# Altium project Tiny817_Xplained_Pro.PrjPCB (part 2 of 2)

## Sheet Tiny817_Xplained_Pro_current_measurement_control.SchDoc: Current measurement control
size A3; Organization: ATMEL Norway; Address1: Vestre Rosten 79; Address2: N-7075 TILLER; Address3: NORWAY; DocumentNumber: A09-2654; Revision: 8; SheetNumber: 6; SheetTotal: 9; PageSetup: Record=PageOptions|CenterHorizontal=True|CenterVertical=True|PrintScale=1.01|XCorrection=1.00|YCorrection=1.00|PrintKind=1|BorderSize=5000000|LeftOffset=0|BottomOffset=0|Orientation=2|PaperLength=1000|PaperWidth=1000|Scale=100|PaperSource=7|PrintQuality=-4|MediaType=1|DitherType=10|PaperKind=A3 (297 x 420 mm)|PrintScaleMode=1; ProjectTitle: Tiny817 Xplained Pro; PCBNumber: A08-2506; PCBRevision: 4
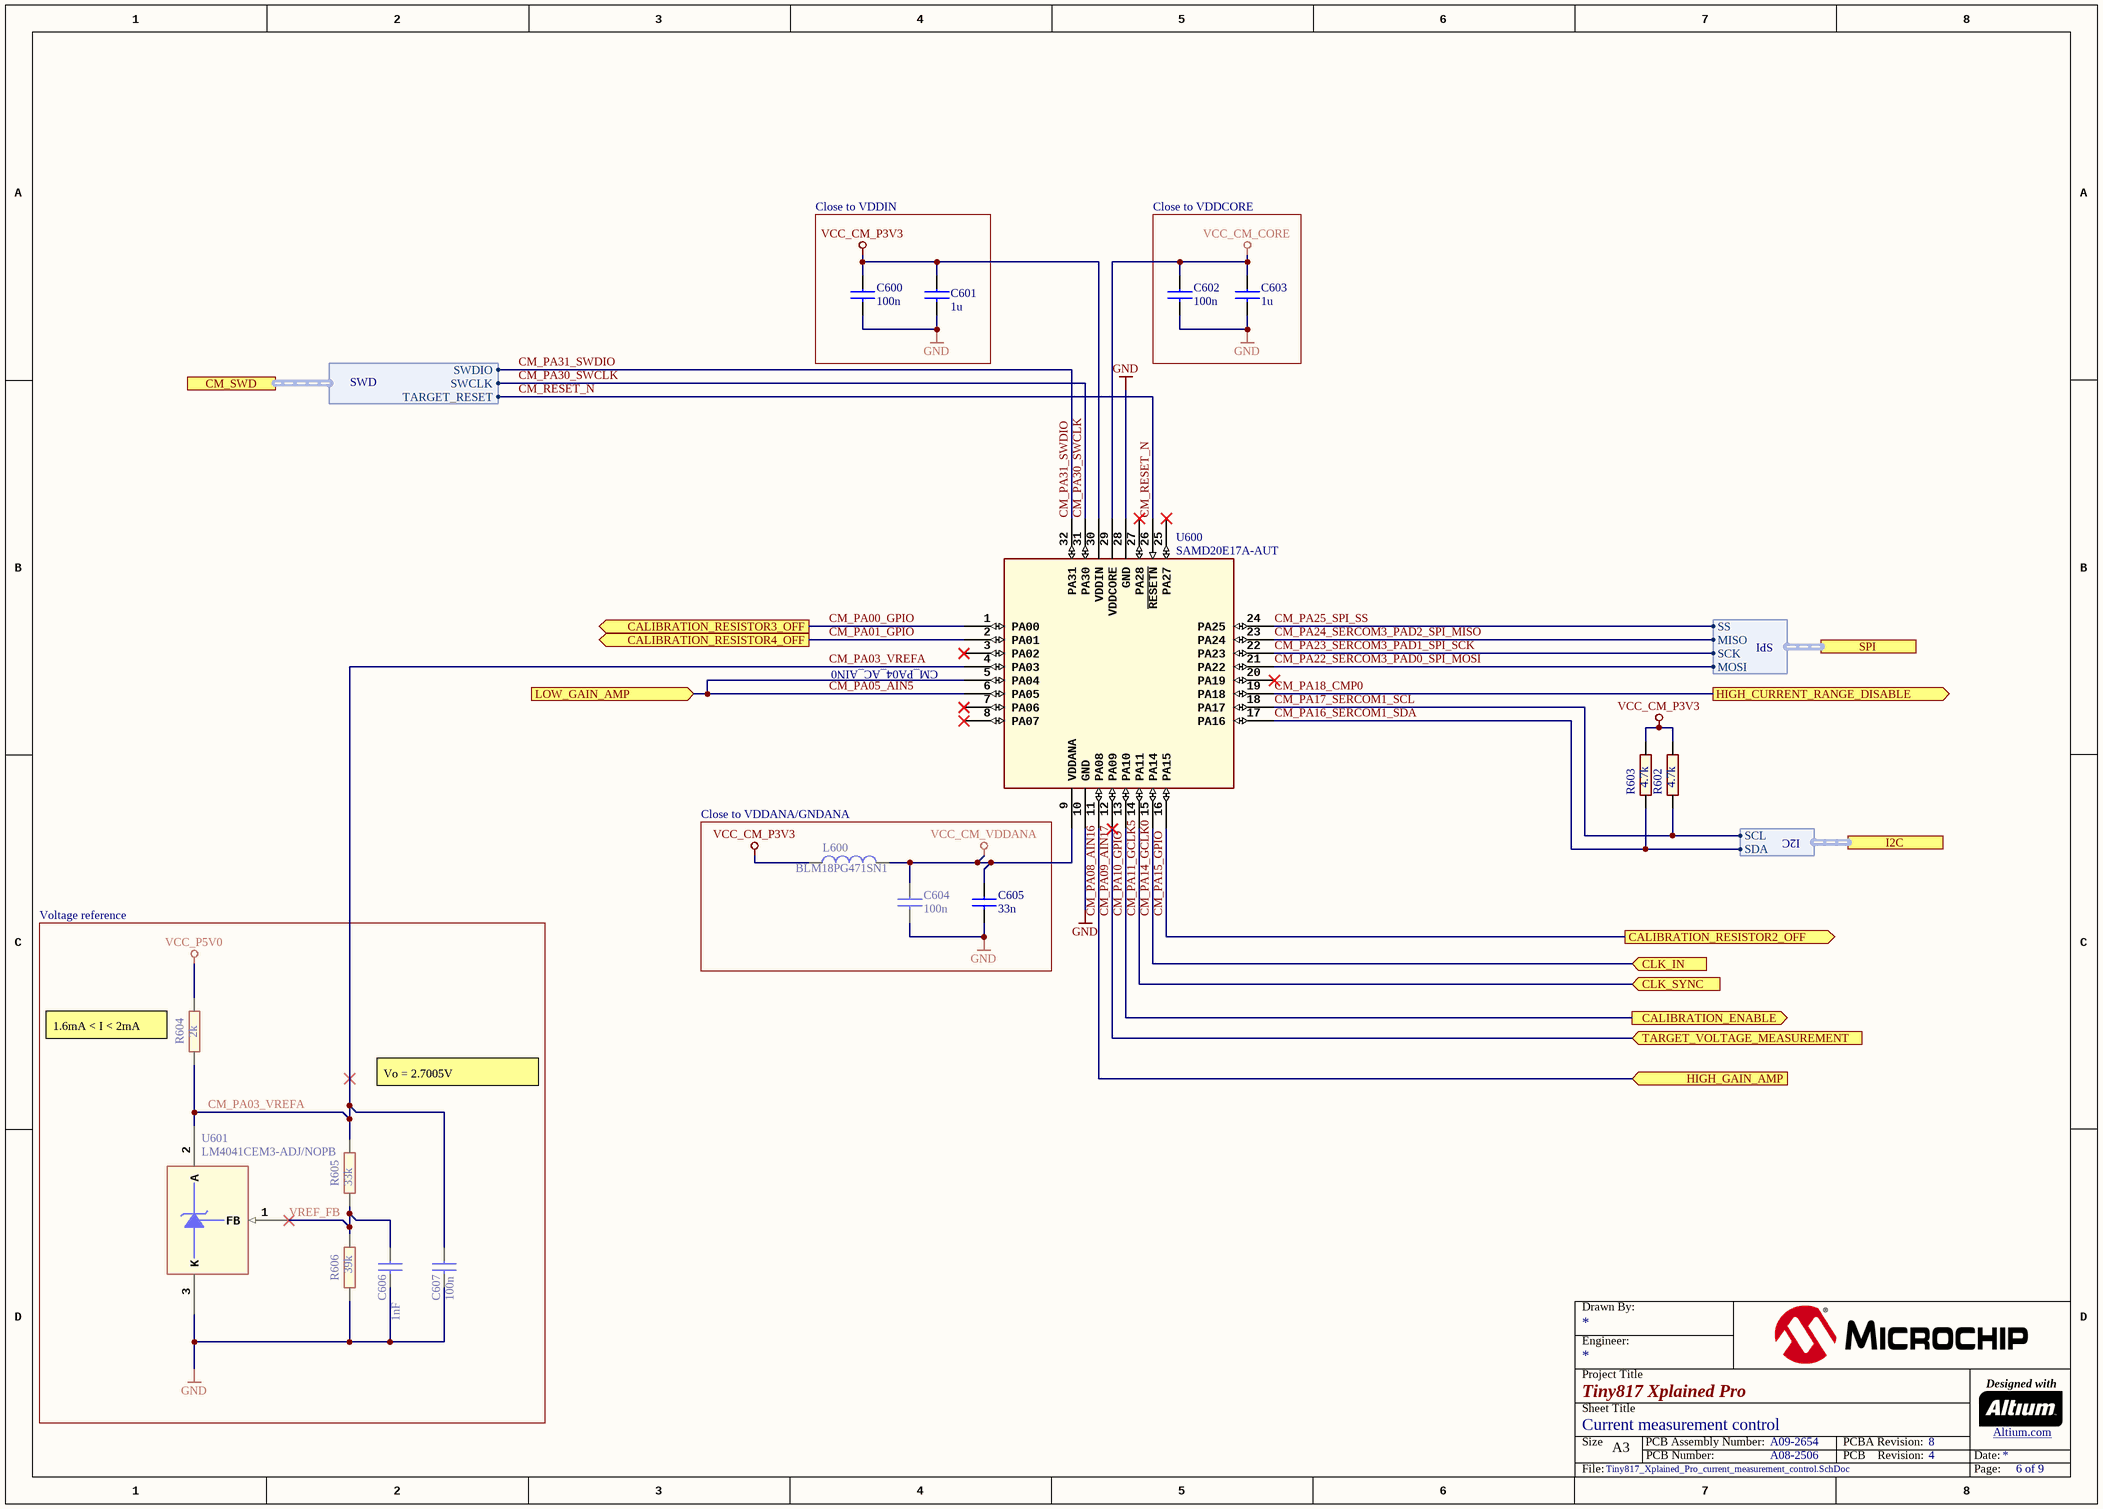
[diagram p7: Tiny817_Xplained_Pro_current_measurement_control.SchDoc]

### Parts
C600  value 100n  [AP1-00053]
C601  value 1u  [AP1-00001]
C602  value 100n  [AP1-00053]
C603  value 1u  [AP1-00001]
C604  value 100n  [AP1-00053]
C605  value 33n  [AP1-00053]
C606  value 1nF  [AP1-00053]
C607  value 100n  [AP1-00053]
L600  value BLM18PG471SN1  [AP3-00005]
R602  value 4.7k  [AP2-00011]
R603  value 4.7k  [AP2-00011]
R604  value 2k  [AP2-00011]
R605  value 33k  [AP2-00011]
R606  value 39k  [AP2-00011]
U600  value SAMD20E17A-AUT  [AP6-00061]
U601  value LM4041CEM3-ADJ/NOPB  [AP5-00002]

### Blocks framed on the sheet
Close to VDDIN: C600 C601
Close to VDDCORE: C602 C603
Close to VDDANA/GNDANA: C604 C605 L600
Voltage reference: C606 C607 R604-R606 U601

### Ports
CALIBRATION_ENABLE (out), CALIBRATION_RESISTOR2_OFF (out), CALIBRATION_RESISTOR3_OFF (out), CALIBRATION_RESISTOR4_OFF (out), CLK_IN (in), CLK_SYNC (in), CM_SWD (harness SWD), HIGH_CURRENT_RANGE_DISABLE (out), HIGH_GAIN_AMP (in), I2C (harness I2C), LOW_GAIN_AMP (in), SPI (harness SPI), TARGET_VOLTAGE_MEASUREMENT (in)

### Harnesses
SPI: MISO, MOSI, SCK, SS
I2C: SCL, SDA
SWD: SWCLK, SWDIO, TARGET_RESET

### Nets
GND: C600.2 C601.2 C602.2 C603.2 C604.2 C605.2 C606.2 C607.2 R606.1 U600.10(GND) U600.28(GND) U601.3(K)
VCC_CM_CORE: C602.1 C603.1 U600.29(VDDCORE)
VCC_CM_P3V3: C600.1 C601.1 L600.1 R602.2 R603.2 U600.30(VDDIN)
VCC_CM_VDDANA: C604.1 C605.1 L600.2 U600.9(VDDANA)
VCC_P5V0: R604.2
CM_PA00_GPIO: U600.1(PA00) ; port CALIBRATION_RESISTOR3_OFF
CM_PA01_GPIO: U600.2(PA01) ; port CALIBRATION_RESISTOR4_OFF
CM_PA03_VREFA: C607.1 R604.1 R605.2 U600.4(PA03) U601.2(A)
CM_PA05_AIN5: U600.5(PA04) U600.6(PA05) ; port LOW_GAIN_AMP
CM_PA08_AIN16: U600.11(PA08) ; port HIGH_GAIN_AMP
CM_PA09_AIN17: U600.12(PA09) ; port TARGET_VOLTAGE_MEASUREMENT
CM_PA10_GPIO: U600.13(PA10) ; port CALIBRATION_ENABLE
CM_PA11_GCLK5: U600.14(PA11) ; port CLK_SYNC
CM_PA14_GCLK0: U600.15(PA14) ; port CLK_IN
CM_PA15_GPIO: U600.16(PA15) ; port CALIBRATION_RESISTOR2_OFF
CM_PA16_SERCOM1_SDA: R603.1 U600.17(PA16) ; port I2C.SDA
CM_PA17_SERCOM1_SCL: R602.1 U600.18(PA17) ; port I2C.SCL
CM_PA18_CMP0: U600.19(PA18) ; port HIGH_CURRENT_RANGE_DISABLE
CM_PA22_SERCOM3_PAD0_SPI_MOSI: U600.21(PA22) ; port SPI.MOSI
CM_PA23_SERCOM3_PAD1_SPI_SCK: U600.22(PA23) ; port SPI.SCK
CM_PA24_SERCOM3_PAD2_SPI_MISO: U600.23(PA24) ; port SPI.MISO
CM_PA25_SPI_SS: U600.24(PA25) ; port SPI.SS
CM_PA30_SWCLK: U600.31(PA30) ; port CM_SWD.SWCLK
CM_PA31_SWDIO: U600.32(PA31) ; port CM_SWD.SWDIO
CM_RESET_N: U600.26(~{RESETN}) ; port CM_SWD.TARGET_RESET
VREF_FB: C606.1 R605.1 R606.2 U601.1(FB)

Not connected (* = marked no-connect by the designer): U600 3(PA02)* 7(PA06)* 8(PA07)* 20(PA19)* 25(PA27)* 27(PA28)*

### Notes on the sheet
- CM_PA04_AC_AIN0
- (near R604) 1.6mA < I < 2mA
- Vo = 2.7005V
- Drawn By:
- Project Title
- Engineer:
- Designed with
- Sheet Title
- Size
- A3
- PCB Number:
- PCB Assembly Number:
- PCBA Revision:
- PCB    Revision:
- Date:
- Altium.com <http://go.altium.com/MicrochipLandingPage_Evaluation.html>
- File:
- Page:

### Library data of the parts
C600 C602 C604 C607 = A01-0246: as C304 on sheet Tiny817_Xplained_Pro_Target_MCU; AN: A01-0246; Tolerance: 16V, +/-10%; Height: 0.5
C601 C603 = A01-0286: Ceramic capacitor, SMD 0402, X5R, 6.3V, +/-10% (de26942); PartGroup: Capacitors,Ceramic,SMD 0402; Manufacturer: Kemet; MPN: C0402C105K9PAC; TemperatureRange: -55 to 85 deg C; AN: A01-0286; Tolerance: +/-10%; Height: 0.5
C605 = A01-0397: Ceramic capacitor, SMD 0402, X7R, 25V, ±10%; PartGroup: Capacitors,Ceramic,SMD 0402; Manufacturer: Murata; MPN: GRM155R71E333KA88D; Tolerance: ±10%(K); TemperatureRange: -55 to 125°C; AN: A01-0397; Height: 0.5
C606 = A01-0321: Ceramic capacitor, SMD 0402, C0G, 50V, +/-5%; PartGroup: Capacitors,Ceramic,SMD 0402; Manufacturer: Murata; MPN: GRM1555C1H102JA01D; Tolerance: 5%; AN: A01-0321; Height: 0.550000011920929
L600 = A03-0035: SMD RF inductor 0603. Z=470Ohm (@100MHz), Max R(dc)=0.20Ohm, Max current=1A; PartGroup: Inductors,EMI; Manufacturer: Murata; TemperatureRange: -55; AN: A03-0035; Height: 0.800000011920929; MPN: BLM18PG471SN1
R602 R603 = A02-0228: Thick film resistor, SMD 0402, 1/16W, 1%; PartGroup: Resistors,SMD,0402 1%; Manufacturer: Panasonic; MPN: ERJ2RKF4701X; TemperatureRange: -55C to +125C; AN: A02-0228; Tolerance: 1 %; Height: 0.349999994039536
R604 = A02-0219: Thick film resistor, SMD 0402, 1/16W, 1%; PartGroup: Resistors,SMD,0402 1%; TemperatureRange: -55 - +125 deg C; AN: A02-0219; Tolerance: 1 %; Height: 0.349999994039536
R605 = A02-0248: Thick film resistor, SMD 0402, 1/16W, 1%; PartGroup: Resistors,SMD,0402 1%; Manufacturer: ASJ Holdings; MPN: CR10-3302-FK; TemperatureRange: -55 - +125 deg C; AN: A02-0248; Tolerance: 1 %; Height: 0.349999994039536
R606 = A02-0250: Thick film resistor, SMD 0402, 1/16W, 1%; PartGroup: Resistors,SMD,0402 1%; Manufacturer: ASJ Holdings; MPN: CR10-3902-FK; TemperatureRange: -55 - +125 deg C; AN: A02-0250; Tolerance: 1 %; Height: 0.349999994039536
U600 = A06-1023: Atmel 32bit RISC MCU 32 pin; PartGroup: Integrated Circuits,MCU, MPU, DSP,ARM MCU; Manufacturer: Microchip; MPN: ATSAMD20E17A-AUT; AN: A06-1023; Height: 1.20000004768372
U601 = A06-0123: Adjustable shunt voltage regulator, 1.24 to 10V out; PartGroup: Integrated Circuits,Regulators,Voltage reference; Manufacturer: Texas Instruments; TemperatureRange: -40 to +85 deg. C; AN: A06-0123; Height: 1; MPN: LM4041CEM3-ADJ/NOPB

## Sheet Tiny817_Xplained_Pro_current_measurement_frontend.SchDoc: Current measurement frontend
size A3; Organization: ATMEL Norway; Address1: Vestre Rosten 79; Address2: N-7075 TILLER; Address3: NORWAY; DocumentNumber: A09-2654; Revision: 8; SheetNumber: 7; SheetTotal: 9; PageSetup: Record=PageOptions|CenterHorizontal=True|CenterVertical=True|PrintScale=1.01|XCorrection=1.00|YCorrection=1.00|PrintKind=1|BorderSize=5000000|LeftOffset=0|BottomOffset=0|Orientation=2|PaperLength=1000|PaperWidth=1000|Scale=100|PaperSource=7|PrintQuality=-4|MediaType=1|DitherType=10|PaperKind=A3 (297 x 420 mm)|PrintScaleMode=1; ProjectTitle: Tiny817 Xplained Pro; PCBNumber: A08-2506; PCBRevision: 4
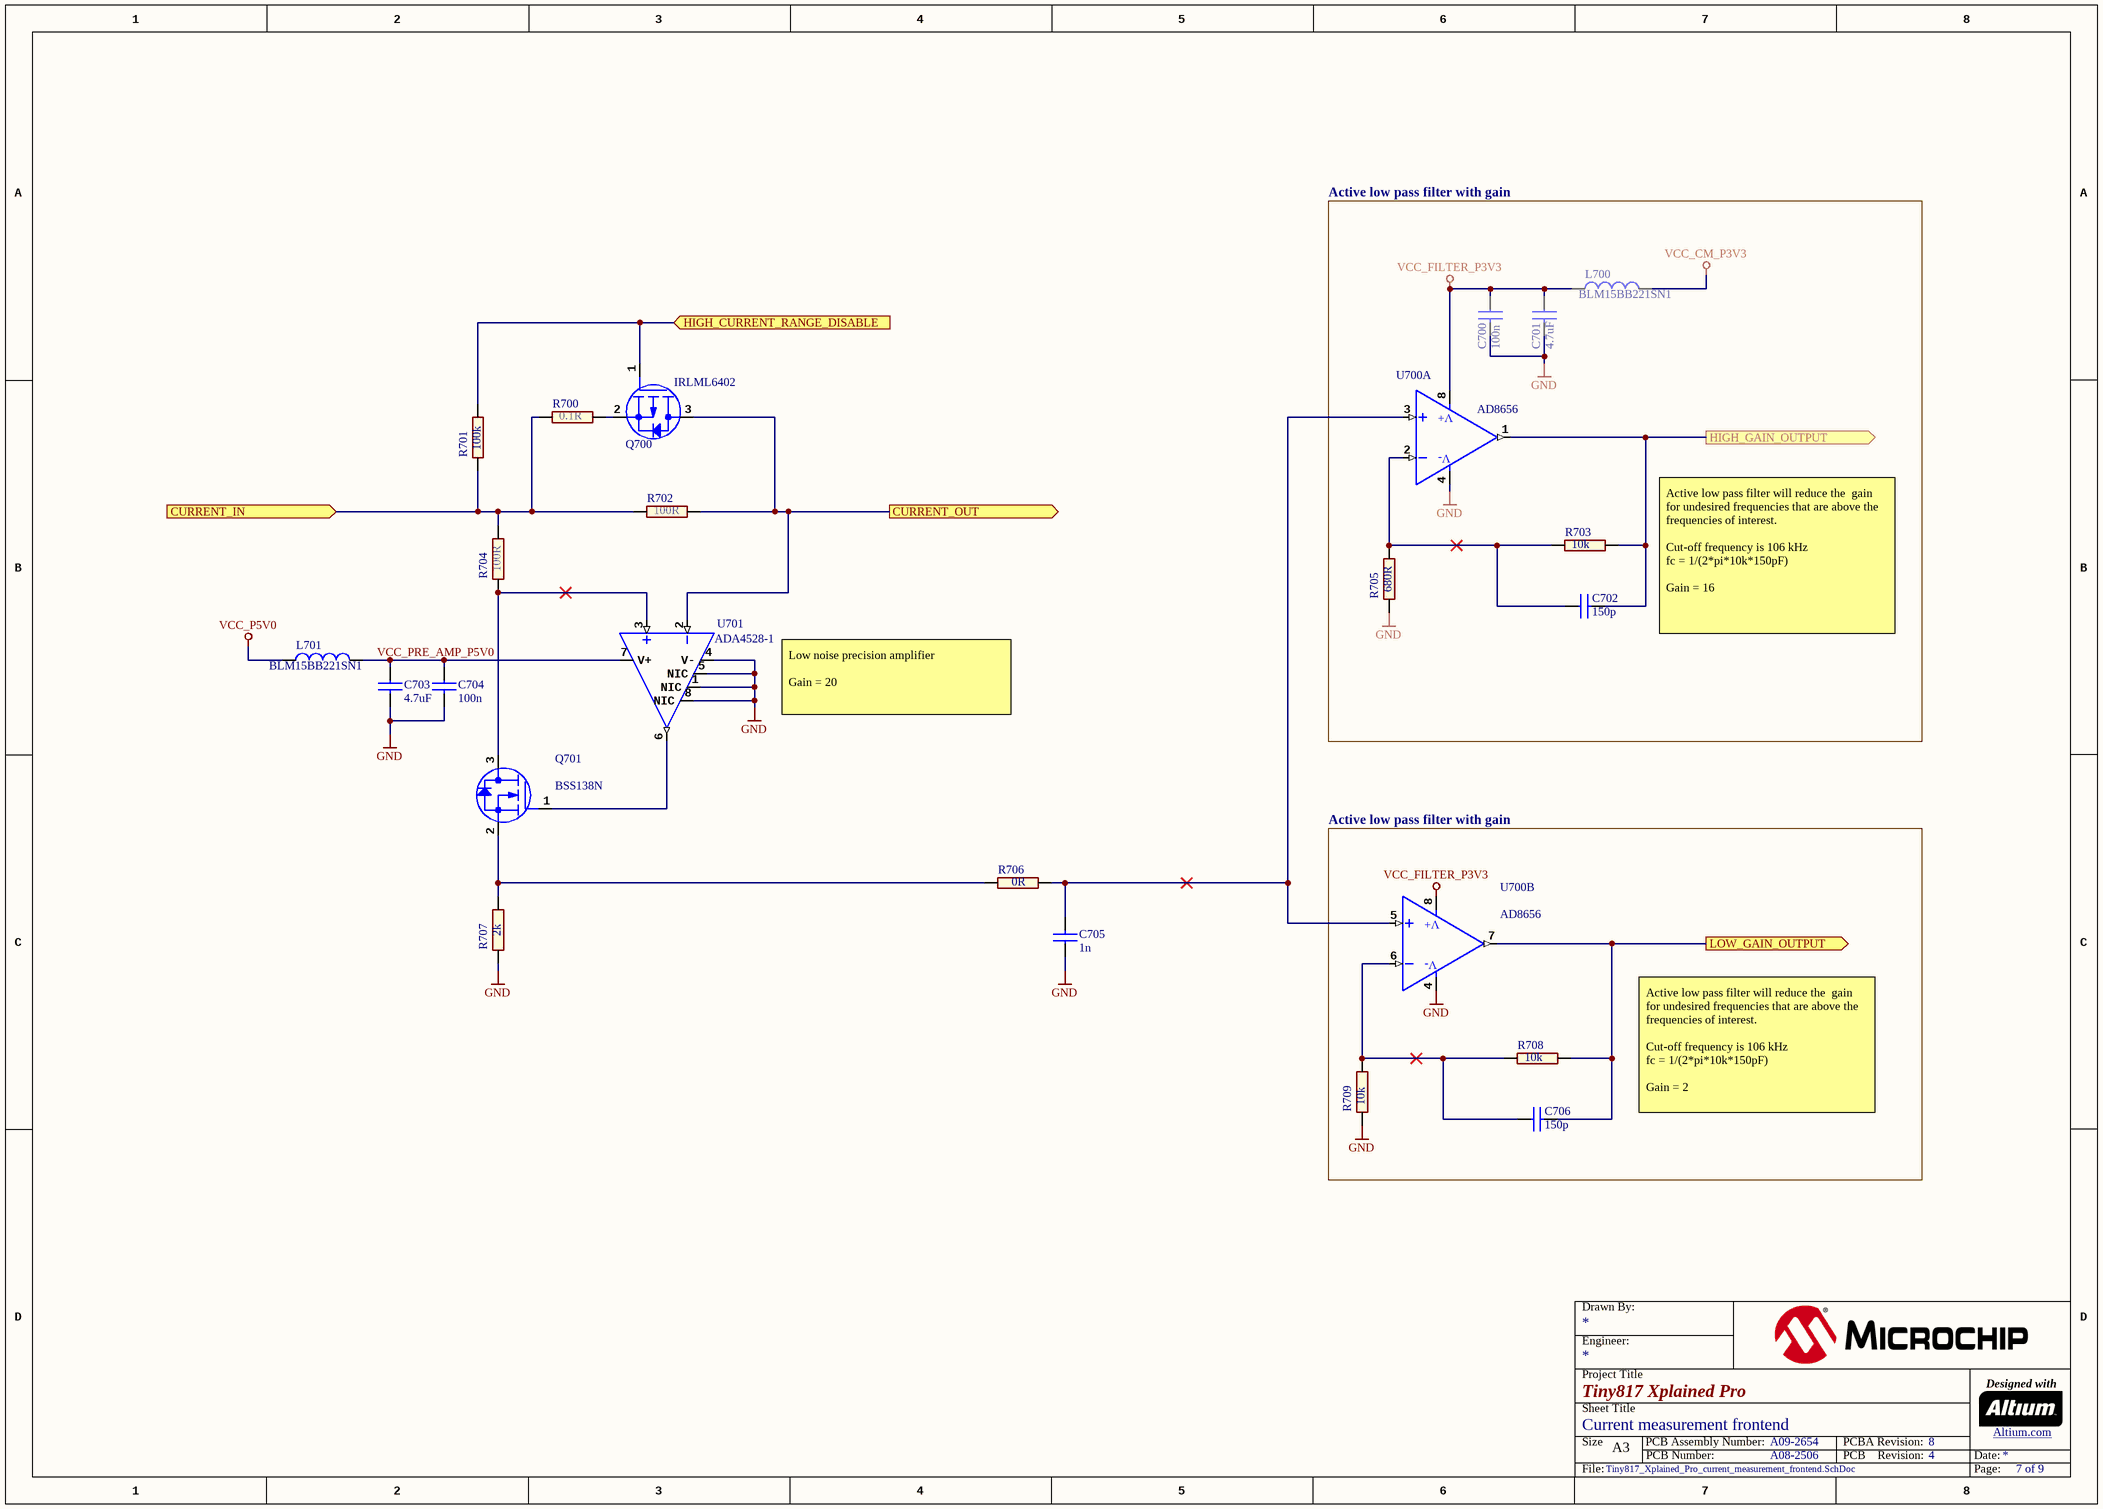
[diagram p8: Tiny817_Xplained_Pro_current_measurement_frontend.SchDoc]

### Parts
C700  value 100n  [AP1-00053]
C701  value 4.7uF  [AP1-00117]
C702  value 150p  [AP1-00053]
C703  value 4.7uF  [AP1-00117]
C704  value 100n  [AP1-00053]
C705  value 1n  [AP1-00053]
C706  value 150p  [AP1-00053]
L700  value BLM15BB221SN1  [AP3-00028]
L701  value BLM15BB221SN1  [AP3-00028]
Q700  value IRLML6402  [AP5-00002]
Q701  value BSS138N  [AP5-00002]
R700  value 0.1R  [AP2-00076]
R701  value 100k  [AP2-00011]
R702  value 100R  [AP2-00076]
R703  value 10k  [AP2-00011]
R704  value 100R  [AP2-00076]
R705  value 680R  [AP2-00011]
R706  value 0R  [AP2-00011]
R707  value 2k  [AP2-00076]
R708  value 10k  [AP2-00011]
R709  value 10k  [AP2-00011]
U700  value AD8656  [AP6-00100]  (parts A,B of 2)
U701  value ADA4528-1  [AP6-00100]

### Blocks framed on the sheet
Active low pass filter with gain: C700-C702 L700 R703 R705 U700
Active low pass filter with gain: C706 R708 R709 U700

### Ports
CURRENT_IN (in), CURRENT_OUT (out), HIGH_CURRENT_RANGE_DISABLE (in), HIGH_GAIN_OUTPUT (out), LOW_GAIN_OUTPUT (out)

### Nets
GND: C700.2 C701.2 C703.2 C704.2 C705.1 R705.1 R707.1 R709.1 U700.4(V-) U701.1(NIC) U701.4(V-) U701.5(NIC) U701.8(NIC)
VCC_CM_P3V3: L700.1
VCC_FILTER_P3V3: C700.1 C701.1 L700.2 U700.8(V+)
VCC_P5V0: L701.1
CM_PA05_AIN5: C706.2 R708.2 U700.7(OUTB) ; port LOW_GAIN_OUTPUT
CM_PA08_AIN16: C702.2 R703.2 U700.1(OUTA) ; port HIGH_GAIN_OUTPUT
CM_PA18_CMP0: Q700.1(G) R701.2 ; port HIGH_CURRENT_RANGE_DISABLE
VCC_CM_IN_P3V3: R700.1 R701.1 R702.1 R704.2 ; port CURRENT_IN
VCC_PRE_AMP_P5V0: C703.1 C704.1 L701.2 U701.7(V+)
NetC702_1: C702.1 R703.1 R705.2 U700.2(INA_-)
NetC705_2: C705.2 R706.1 U700.3(INA_+) U700.5(INB_+)
NetC706_1: C706.1 R708.1 R709.2 U700.6(INB_-)
NetQ500_2: Q700.3(D) R702.2 U701.2(IN-) ; port CURRENT_OUT
NetQ700_2: Q700.2(S) R700.2
NetQ701_1: Q701.1(G) U701.6(OUT)
NetQ701_2: Q701.2(S) R706.2 R707.2
NetQ701_3: Q701.3(D) R704.1 U701.3(IN+)

### Notes on the sheet
- Active low pass filter will reduce the  gain for undesired frequencies that are above the frequencies of interest.
  Cut-off frequency is 106 kHz
  fc = 1/(2*pi*10k*150pF)
  Gain = 16
- Low noise precision amplifier
  Gain = 20
- Active low pass filter will reduce the  gain for undesired frequencies that are above the frequencies of interest.
  Cut-off frequency is 106 kHz
  fc = 1/(2*pi*10k*150pF)
  Gain = 2
- Drawn By:
- Project Title
- Engineer:
- Designed with
- Sheet Title
- Size
- A3
- PCB Number:
- PCB Assembly Number:
- PCBA Revision:
- PCB    Revision:
- Date:
- Altium.com <http://go.altium.com/MicrochipLandingPage_Evaluation.html>
- File:
- Page:

### Library data of the parts
C700 C704 = A01-0246: Ceramic capacitor, SMD 0402, X7R, 16V, +/-10%; PartGroup: Capacitors,Ceramic,SMD 0402; Manufacturer: Kemet; MPN: C0402C104K4RACTU; TemperatureRange: -55 - +125 deg C; AN: A01-0246; Tolerance: 16V, +/-10%; Height: 0.5
C701 C703 = A01-0377: Ceramic capacitor, SMD 0603, X5R, 10V, 10% (de31036); PartGroup: Capacitors,Ceramic,SMD 0603; Manufacturer: WALSIN Technology Corporation; MPN: 0603X475K100CT; TemperatureRange: -55 - +85 deg C; AN: A01-0377; Tolerance: 10%; Height: 0.800000011920929
C702 C706 = A01-0028: Ceramic capacitor, SMD 0402, X7R, 50V, +/-10%; PartGroup: Capacitors,Ceramic,SMD 0402; Manufacturer: Yageo; MPN: CC0402KRX7R9BB151; TemperatureRange: -55 - +125 deg C; AN: A01-0028; Tolerance: 50V, +/-10%; Height: 0.550000011920929
C705 = A01-0038: Ceramic capacitor, SMD 0402, X7R, 50V, +/-10%; PartGroup: Capacitors,Ceramic,SMD 0402; Manufacturer: Yageo; MPN: CC0402KRX7R9BB102; TemperatureRange: -55 - +125 deg C; AN: A01-0038; Tolerance: 50V, +/-10%; Height: 0.550000011920929
L700 L701 = A03-0037: SMD RF inductor 0402. Z=220Ohm (@100MHz), Max R(dc)=0.80Ohm, Max current=200mA; PartGroup: Inductors,EMI; Manufacturer: Murata; Tolerance: ±25%; TemperatureRange: -55°C to +125°C; AN: A03-0037; Height: 0.5; MPN: BLM15BB221SN1
Q700 = A05-0087: P-ch. MOSFET. -30V, -3.7A continuous,RDS(ON)=0.05Ohm@VGS=-4,5V, RDS(ON)=0.08Ohm@VGS=-2.5V; PartGroup: Transistors,Power FET,SMD; Manufacturer: International Rectifier; MPN: IRLML6402PBF; TemperatureRange: -55 - +150 deg C; AN: A05-0087; Height: 1.14999997615814
Q701 = A05-0140: Low leakage N-Channel MOSFET. 60V, 0.23A continuous, 0.92A Peak. RDS(ON) = 3.5Ohm@VGS=4.5V, VGS(th)<1.4V; PartGroup: Transistors,Small signal FET,SMD; Manufacturer: Infineon; TemperatureRange: -55  to +150 deg celcius; AN: A05-0140; Height: 1.10000002384186; MPN: BSS138N
R700 = A02-0896: WSL0603R1000FEA, metal strip resistor, 0.1 Ohm, +-1%, 0603 SMD, 1/10 W, TEMPCO +-75 ppm/Â°C; PartGroup: Resistors,Sense resistors,SMD Current Sense; Manufacturer: Vishay; AN: A02-0896; Height: 0.330000013113022; MPN: WSL0603R1000FEA
R701 = A02-0260: Thick film resistor, SMD 0402, 1/16W, 1%; PartGroup: Resistors,SMD,0402 1%; Manufacturer: ASJ Holdings; MPN: CR10-1003-FK; TemperatureRange: -55ï¿½ to +125ï¿½C; AN: A02-0260; Tolerance: 1 %; Height: 0.349999994039536
R702 R704 = A02-0895: ERA-3YEB101V, metal film, 100R Â±0.1%, resistor in 0603 at 100mW, TEMPCO Â±25ppm/Â°C, Max V=75V; PartGroup: Resistors,Metal film,SMD Precision resistors; Manufacturer: Panasonic; MPN: ERA3YEB101V; AN: A02-0895; Height: 0.550000011920929
R703 R708 R709 = A02-0236: Thick film resistor, SMD 0402, 1/16W, 1%; PartGroup: Resistors,SMD,0402 1%; Manufacturer: Vishay; MPN: CRCW040210K0FKED; TemperatureRange: -55 - +125 deg C; AN: A02-0236; Tolerance: 1 %; Height: 0.349999994039536
R705 = A02-0208: Thick film resistor, SMD 0402, 1/16W, 1%; PartGroup: Resistors,SMD,0402 1%; Manufacturer: ASJ Holdings; MPN: CR10-6800-FK; TemperatureRange: -55 - +125 deg C; AN: A02-0208; Tolerance: 1 %; Height: 0.349999994039536
R706 = A02-0163: RES 0.0 OHM 1/16W 0402 SMD; PartGroup: Resistors,SMD,0402 1%; Manufacturer: (n/a); MPN: RMCF0402ZT0R00; Tolerance: 1 %; TemperatureRange: -55 - +125 deg C; AN: A02-0163; Height: 0.349999994039536
R707 = A02-0081: Thick film resistor, SMD 0603, 1/10W, 1%; PartGroup: Resistors,SMD,0603 1%; Manufacturer: Yageo; MPN: RC0603FR-072KL; AN: A02-0081; Tolerance: 1 %; Height: 0.5
U700 = A06-1125: AD8656, dual low noise precision OpAmp, rail-to-rail, low offset 250uV, GBP 28 MHz, 8MSOP; PartGroup: Integrated Circuits,General linear,OP-AMP; Manufacturer: Analog Devices; MPN: AD8656ARMZ; TemperatureRange: -40 to +125 deg celcius; AN: A06-1125; Height: 1.10000002384186
U701 = A06-1134: Precision OpAmp, Zero-Drift 0.015uV/K, ultra low noise 5.6nV/sqrt(Hz), Vo=2uV, GBW=4MHz, single supply 2.2V to 5.5V or dual supply +-1V to +-2.75V, rail to rail, unity gain stable; PartGroup: Integrated Circuits,General linear,OP-AMP; Manufacturer: Analog Devices; MPN: ADA4528-1ARMZ; AN: A06-1134; Height: 1.10000002384186

## Nets that join several sheets
GND: Tiny817_Xplained_Pro_Target_MCU (11 pins), Tiny817_Xplained_Pro_EDBG (36 pins), Tiny817_Xplained_Pro_Connectors (6 pins), Tiny817_Xplained_Pro_dual_input_power_supply (16 pins), Tiny817_Xplained_Pro_current_measurement (Q501.2 R500.1 R502.1), Tiny817_Xplained_Pro_current_measurement_calibration (R803.1 R804.1 R805.1 R806.1), Tiny817_Xplained_Pro_current_measurement_control (12 pins), Tiny817_Xplained_Pro_current_measurement_frontend (13 pins)
VCC_CM_P3V3: Tiny817_Xplained_Pro_dual_input_power_supply (R107.1), Tiny817_Xplained_Pro_current_measurement (R501.2), Tiny817_Xplained_Pro_current_measurement_calibration (R800.2 R801.2 R802.2), Tiny817_Xplained_Pro_current_measurement_control (6 pins), Tiny817_Xplained_Pro_current_measurement_frontend (L700.1)
VCC_EDBG_P3V3: Tiny817_Xplained_Pro_EDBG (22 pins), Tiny817_Xplained_Pro_dual_input_power_supply (R108.1)
VCC_EDBG_USB_P5V0: Tiny817_Xplained_Pro_EDBG (C408.1 L401.2 U400.A10), Tiny817_Xplained_Pro_dual_input_power_supply (Q100.1 R100.2)
VCC_EXT_P5V0: Tiny817_Xplained_Pro_Connectors (J202.1), Tiny817_Xplained_Pro_dual_input_power_supply (Q100.2 Q100.5 Q101.1 R101.2)
VCC_MCU_P3V3: Tiny817_Xplained_Pro_Target_MCU (C304.2 C305.2 U300.4), Tiny817_Xplained_Pro_Connectors (J205.4), Tiny817_Xplained_Pro_dual_input_power_supply (J103.1)
VCC_P5V0: Tiny817_Xplained_Pro_Connectors (J202.3), Tiny817_Xplained_Pro_dual_input_power_supply (8 pins), Tiny817_Xplained_Pro_current_measurement_control (R604.2), Tiny817_Xplained_Pro_current_measurement_frontend (L701.1)
VCC_TARGET_P3V3: Tiny817_Xplained_Pro_Target_MCU (5 pins), Tiny817_Xplained_Pro_Connectors (J200.20 J202.4 J203.20), Tiny817_Xplained_Pro_dual_input_power_supply (J101.2)
CM_PA00_GPIO: Tiny817_Xplained_Pro_current_measurement_calibration (Q801.1 R801.1), Tiny817_Xplained_Pro_current_measurement_control (U600.1)
CM_PA01_GPIO: Tiny817_Xplained_Pro_current_measurement_calibration (Q800.1 R802.1), Tiny817_Xplained_Pro_current_measurement_control (U600.2)
CM_PA05_AIN5: Tiny817_Xplained_Pro_current_measurement_control (U600.5 U600.6), Tiny817_Xplained_Pro_current_measurement_frontend (C706.2 R708.2 U700.7)
CM_PA08_AIN16: Tiny817_Xplained_Pro_current_measurement_control (U600.11), Tiny817_Xplained_Pro_current_measurement_frontend (C702.2 R703.2 U700.1)
CM_PA09_AIN17: Tiny817_Xplained_Pro_EDBG (U400.K10), Tiny817_Xplained_Pro_dual_input_power_supply (R109.1 R110.2), Tiny817_Xplained_Pro_current_measurement_control (U600.12)
CM_PA10_GPIO: Tiny817_Xplained_Pro_current_measurement (Q500.1 Q501.1 R500.2), Tiny817_Xplained_Pro_current_measurement_control (U600.13)
CM_PA11_GCLK5: Tiny817_Xplained_Pro_EDBG (U400.J3), Tiny817_Xplained_Pro_current_measurement_control (U600.14)
CM_PA14_GCLK0: Tiny817_Xplained_Pro_EDBG (U400.C1), Tiny817_Xplained_Pro_current_measurement_control (U600.15)
CM_PA15_GPIO: Tiny817_Xplained_Pro_current_measurement_calibration (Q802.1 R800.1), Tiny817_Xplained_Pro_current_measurement_control (U600.16)
CM_PA16_SERCOM1_SDA: Tiny817_Xplained_Pro_EDBG (U400.J7), Tiny817_Xplained_Pro_current_measurement_control (R603.1 U600.17)
CM_PA17_SERCOM1_SCL: Tiny817_Xplained_Pro_EDBG (U400.K7), Tiny817_Xplained_Pro_current_measurement_control (R602.1 U600.18)
CM_PA18_CMP0: Tiny817_Xplained_Pro_current_measurement_control (U600.19), Tiny817_Xplained_Pro_current_measurement_frontend (Q700.1 R701.2)
CM_PA22_SERCOM3_PAD0_SPI_MOSI: Tiny817_Xplained_Pro_EDBG (U400.C2), Tiny817_Xplained_Pro_current_measurement_control (U600.21)
CM_PA23_SERCOM3_PAD1_SPI_SCK: Tiny817_Xplained_Pro_EDBG (U400.C4), Tiny817_Xplained_Pro_current_measurement_control (U600.22)
CM_PA24_SERCOM3_PAD2_SPI_MISO: Tiny817_Xplained_Pro_EDBG (U400.B1), Tiny817_Xplained_Pro_current_measurement_control (U600.23)
CM_PA25_SPI_SS: Tiny817_Xplained_Pro_EDBG (U400.D1), Tiny817_Xplained_Pro_current_measurement_control (U600.24)
CM_PA30_SWCLK: Tiny817_Xplained_Pro_EDBG (U400.F4), Tiny817_Xplained_Pro_current_measurement_control (U600.31)
CM_PA31_SWDIO: Tiny817_Xplained_Pro_EDBG (U400.E3), Tiny817_Xplained_Pro_current_measurement_control (U600.32)
CM_RESET_N: Tiny817_Xplained_Pro_EDBG (U400.F3), Tiny817_Xplained_Pro_current_measurement_control (U600.26)
ID1: Tiny817_Xplained_Pro_EDBG (R409.1 U400.A1), Tiny817_Xplained_Pro_Connectors (J200.1)
ID3: Tiny817_Xplained_Pro_EDBG (R401.1 U400.B3), Tiny817_Xplained_Pro_Connectors (J203.1)
NetJ101_3: Tiny817_Xplained_Pro_dual_input_power_supply (J101.3 J102.3), Tiny817_Xplained_Pro_current_measurement (Q500.3)
NetQ500_2: Tiny817_Xplained_Pro_current_measurement (Q500.2 Q502.2 R502.2), Tiny817_Xplained_Pro_current_measurement_frontend (Q700.3 R702.2 U701.2)
NetQ502_3: Tiny817_Xplained_Pro_current_measurement (Q502.3), Tiny817_Xplained_Pro_current_measurement_calibration (Q800.2 Q801.2 Q802.2 R806.2)
PA0_UPDI_RST: Tiny817_Xplained_Pro_Target_MCU (R301.1 U300.23), Tiny817_Xplained_Pro_EDBG (R404.1), Tiny817_Xplained_Pro_Connectors (J205.3)
PA1_I2C_SDA: Tiny817_Xplained_Pro_Target_MCU (R306.1 U300.24), Tiny817_Xplained_Pro_EDBG (R407.2), Tiny817_Xplained_Pro_Connectors (J200.11 J203.11)
PA2_I2C_SCL: Tiny817_Xplained_Pro_Target_MCU (R310.1 U300.1), Tiny817_Xplained_Pro_EDBG (R408.2), Tiny817_Xplained_Pro_Connectors (J200.12 J203.12)
PA3_GPIO_SS: Tiny817_Xplained_Pro_Target_MCU (U300.2), Tiny817_Xplained_Pro_Connectors (J203.15)
PA4_GPIO: Tiny817_Xplained_Pro_Target_MCU (U300.5), Tiny817_Xplained_Pro_Connectors (J200.10)
PA5_IRQ_GPIO: Tiny817_Xplained_Pro_Target_MCU (U300.6), Tiny817_Xplained_Pro_Connectors (J200.9)
PA6_AIN6: Tiny817_Xplained_Pro_Target_MCU (R302.2 U300.7), Tiny817_Xplained_Pro_Connectors (J200.3)
PA7_AIN7: Tiny817_Xplained_Pro_Target_MCU (R305.2 U300.8), Tiny817_Xplained_Pro_Connectors (J200.4)
PB0_PWM_W0: Tiny817_Xplained_Pro_Target_MCU (U300.16), Tiny817_Xplained_Pro_Connectors (J200.7)
PB1_PWM_W1: Tiny817_Xplained_Pro_Target_MCU (U300.15), Tiny817_Xplained_Pro_Connectors (J200.8)
PB2_UART_TXD: Tiny817_Xplained_Pro_Target_MCU (R307.1), Tiny817_Xplained_Pro_EDBG (R406.2), Tiny817_Xplained_Pro_Connectors (J200.14 J203.14)
PB3_UART_RXD: Tiny817_Xplained_Pro_Target_MCU (R308.1), Tiny817_Xplained_Pro_EDBG (R414.1), Tiny817_Xplained_Pro_Connectors (J200.13 J203.13)
PB4_GPIO2: Tiny817_Xplained_Pro_Target_MCU (D301.1 U300.12), Tiny817_Xplained_Pro_Connectors (J200.6)
PB5_GPIO: Tiny817_Xplained_Pro_Target_MCU (R300.2 U300.11), Tiny817_Xplained_Pro_EDBG (R416.1), Tiny817_Xplained_Pro_Connectors (J203.10)
PB6_IRQ_GPIO: Tiny817_Xplained_Pro_Target_MCU (U300.10), Tiny817_Xplained_Pro_EDBG (R417.1), Tiny817_Xplained_Pro_Connectors (J203.9)
PB7_GPIO1: Tiny817_Xplained_Pro_Target_MCU (U300.9), Tiny817_Xplained_Pro_Connectors (J200.5)
PC0_SPI_SCK: Tiny817_Xplained_Pro_Target_MCU (U300.17), Tiny817_Xplained_Pro_EDBG (R425.1), Tiny817_Xplained_Pro_Connectors (J200.18 J203.18)
PC1_SPI_MISO: Tiny817_Xplained_Pro_Target_MCU (U300.18), Tiny817_Xplained_Pro_EDBG (R420.2), Tiny817_Xplained_Pro_Connectors (J200.17 J203.17)
PC2_SPI_MOSI: Tiny817_Xplained_Pro_Target_MCU (U300.19), Tiny817_Xplained_Pro_EDBG (R415.1), Tiny817_Xplained_Pro_Connectors (J200.16 J203.16)
PC3_SPI_SS: Tiny817_Xplained_Pro_Target_MCU (U300.20), Tiny817_Xplained_Pro_Connectors (J200.15)
PC4_GPIO_SS: Tiny817_Xplained_Pro_Target_MCU (U300.21), Tiny817_Xplained_Pro_EDBG (R426.1)
PC5_GPIO: Tiny817_Xplained_Pro_Target_MCU (R309.1 U300.22), Tiny817_Xplained_Pro_Connectors (J203.5 J205.6)
VCC_CM_IN_P3V3: Tiny817_Xplained_Pro_dual_input_power_supply (J100.1 J101.1 J102.1 R109.2), Tiny817_Xplained_Pro_current_measurement_frontend (R700.1 R701.1 R702.1 R704.2)

## Assembly variants
Default_assembly: not fitted C403 C705 R301 R312 R313 R424